# EAGLE design ArduinoMiniPro Breakout (EAGLE 6.5.0)
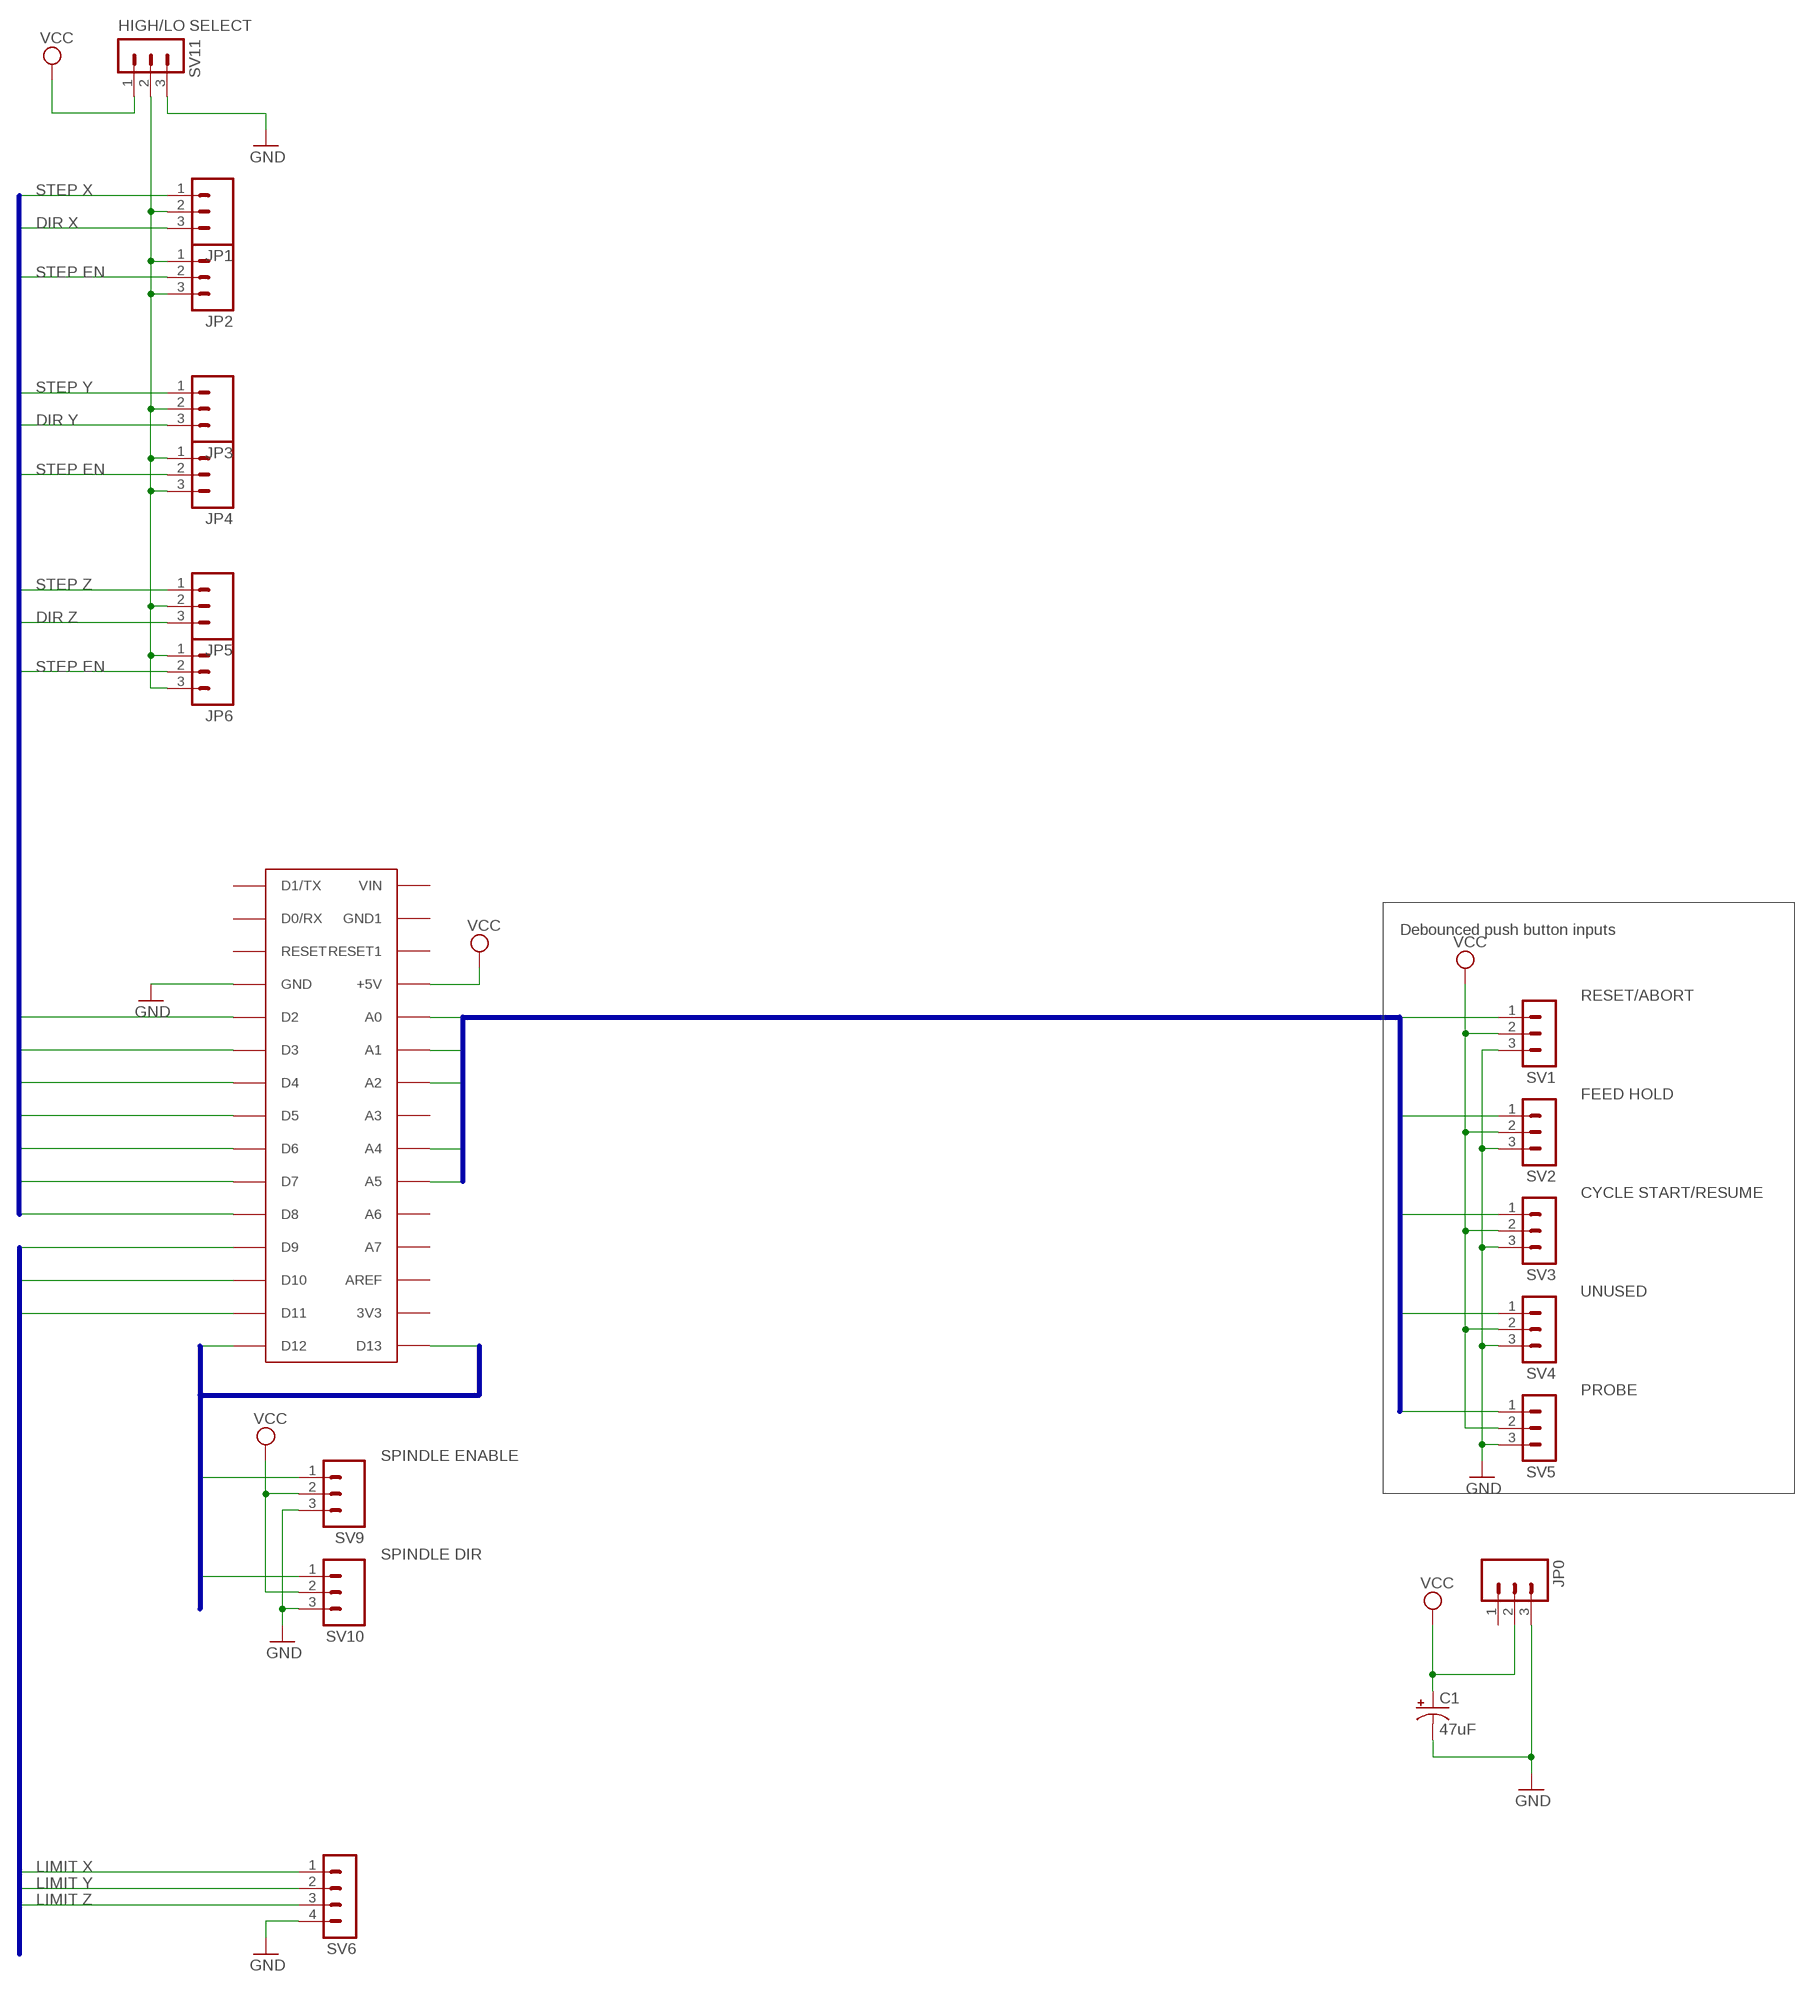
[diagram p0: schematic, sheet 1]

## Parts
C1  47uF  CAP_POLPTH2  [CPOL-RADIAL-10UF-25V]
JP0  M03-SCREW-5MM  [SCREWTERMINAL-5MM-3]
JP1  M03-SCREW-5MM  [SCREWTERMINAL-5MM-3]
JP2  M03-SCREW-5MM  [SCREWTERMINAL-5MM-3]
JP3  M03-SCREW-5MM  [SCREWTERMINAL-5MM-3]
JP4  M03-SCREW-5MM  [SCREWTERMINAL-5MM-3]
JP5  M03-SCREW-5MM  [SCREWTERMINAL-5MM-3]
JP6  M03-SCREW-5MM  [SCREWTERMINAL-5MM-3]
SV1  MA03-1  [MA03-1]
SV2  MA03-1  [MA03-1]
SV3  MA03-1  [MA03-1]
SV4  MA03-1  [MA03-1]
SV5  MA03-1  [MA03-1]
SV6  MA04-1  [MA04-1]
SV9  M03-SCREW-5MM  [SCREWTERMINAL-5MM-3]
SV10  M03-SCREW-5MM  [SCREWTERMINAL-5MM-3]
SV11  MA03-1  [MA03-1]
U$2  ARDUINONANO  [PDIP-32]

## Nets
B0: SV1.1 U$2.A0
B1: SV2.1 U$2.A1
B2: SV3.1 U$2.A2
B4: SV4.1 U$2.A4
B5: SV5.1 U$2.A5
GND: C1.2(-) JP0.3 SV1.3 SV2.3 SV3.3 SV4.3 SV5.3 SV6.4 SV9.3 SV10.3 SV11.3 U$2.GND
LIMITS0: SV6.1 U$2.D9
LIMITS1: SV6.2 U$2.D10
LIMITS2: SV6.3 U$2.D11
N$1: JP1.2 JP2.1 JP2.3 JP3.2 JP4.1 JP4.3 JP5.2 JP6.1 JP6.3 SV11.2
SPINDLE0: SV9.1 U$2.D12
SPINDLE1: SV10.1 U$2.D13
STEP0: JP1.1 U$2.D2
STEP1: JP3.1 U$2.D3
STEP2: JP5.1 U$2.D4
STEP3: JP1.3 U$2.D5
STEP4: JP3.3 U$2.D6
STEP5: JP5.3 U$2.D7
STEP6: JP2.2 JP4.2 JP6.2 U$2.D8
VCC: C1.1(+) JP0.2 SV1.2 SV2.2 SV3.2 SV4.2 SV5.2 SV9.2 SV10.2 SV11.1 U$2.+5V
Unconnected: JP0.1 U$2.3V3 U$2.A3 U$2.A6 U$2.A7 U$2.AREF U$2.D0/RX U$2.D1/TX U$2.GND1 U$2.RESET U$2.RESET1 U$2.VIN

## Buses
BUTTONS[0..5]
LIMITS[0..2]
SPINDLE[0..1]
STEP[0..6]

## Notes on the sheet
- HIGH/LO SELECT
- STEP X
- DIR X
- STEP EN
- STEP Y
- DIR Y
- STEP EN
- STEP Z
- DIR Z
- STEP EN
- Debounced push button inputs
- RESET/ABORT
- FEED HOLD
- CYCLE START/RESUME
- UNUSED
- PROBE
- SPINDLE ENABLE
- SPINDLE DIR
- LIMIT X
- LIMIT Y
- LIMIT Z

## Library data of the parts
C1 = SparkFun-Passives:CAP_POL: Capacitor Polarized These are standard SMD and PTH capacitors. Normally 10uF, 47uF, and 100uF in electrolytic and tantalum varieties. Always verify the external diameter of the through hole cap, it varies with capacity, voltage, and manufacturer. The EIA devices should be standard.
JP0 = MY-Connectors:M03: Header 3 Standard 3-pin 0.1" header. Use with straight break away headers (SKU : PRT-00116), right angle break away headers (PRT-00553), swiss pins (PRT-00743), machine pins (PRT-00117), and female headers (PRT-00115). Molex polarized connector foot print use with SKU : PRT-08232 with associated crimp pins and housings.; STOREFRONT_ID: PRT-08433
JP1-JP6 SV9 SV10 = SparkFun-Connectors:M03: Header 3 Standard 3-pin 0.1" header. Use with straight break away headers (SKU : PRT-00116), right angle break away headers (PRT-00553), swiss pins (PRT-00743), machine pins (PRT-00117), and female headers (PRT-00115). Molex polarized connector foot print use with SKU : PRT-08232 with associated crimp pins and housings.; STOREFRONT_ID: PRT-08433
SV1-SV5 SV11 = con-lstb:MA03-1: PIN HEADER; OC_FARNELL: unknown; OC_NEWARK: unknown
SV6 = con-lstb:MA04-1: PIN HEADER; OC_FARNELL: unknown; OC_NEWARK: unknown
U$2 = rocketfarm:ARDUINONANO

## Board
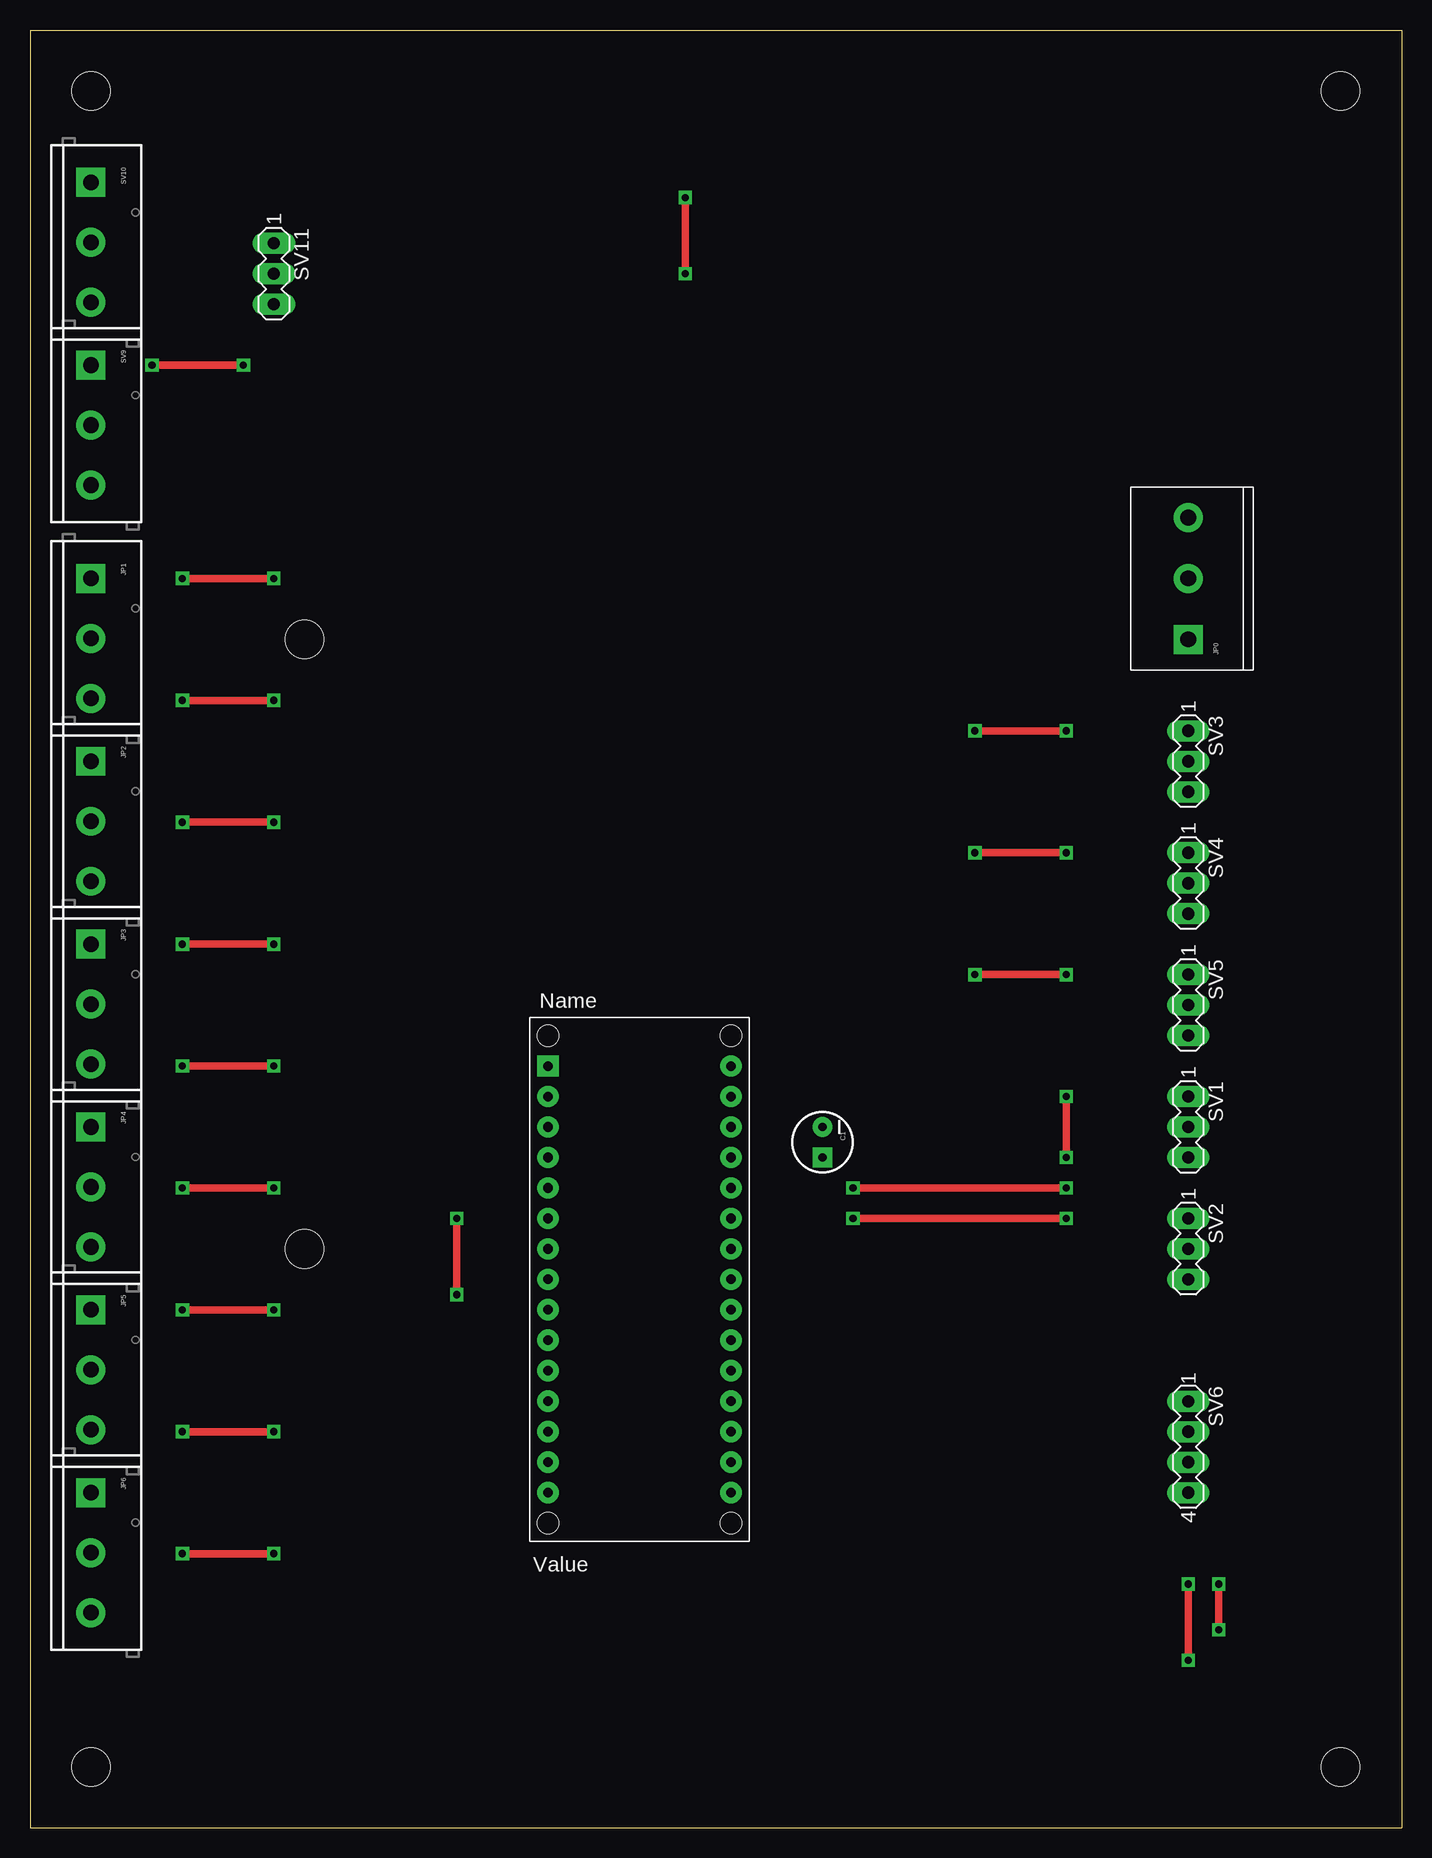
[diagram p1: board, top side]
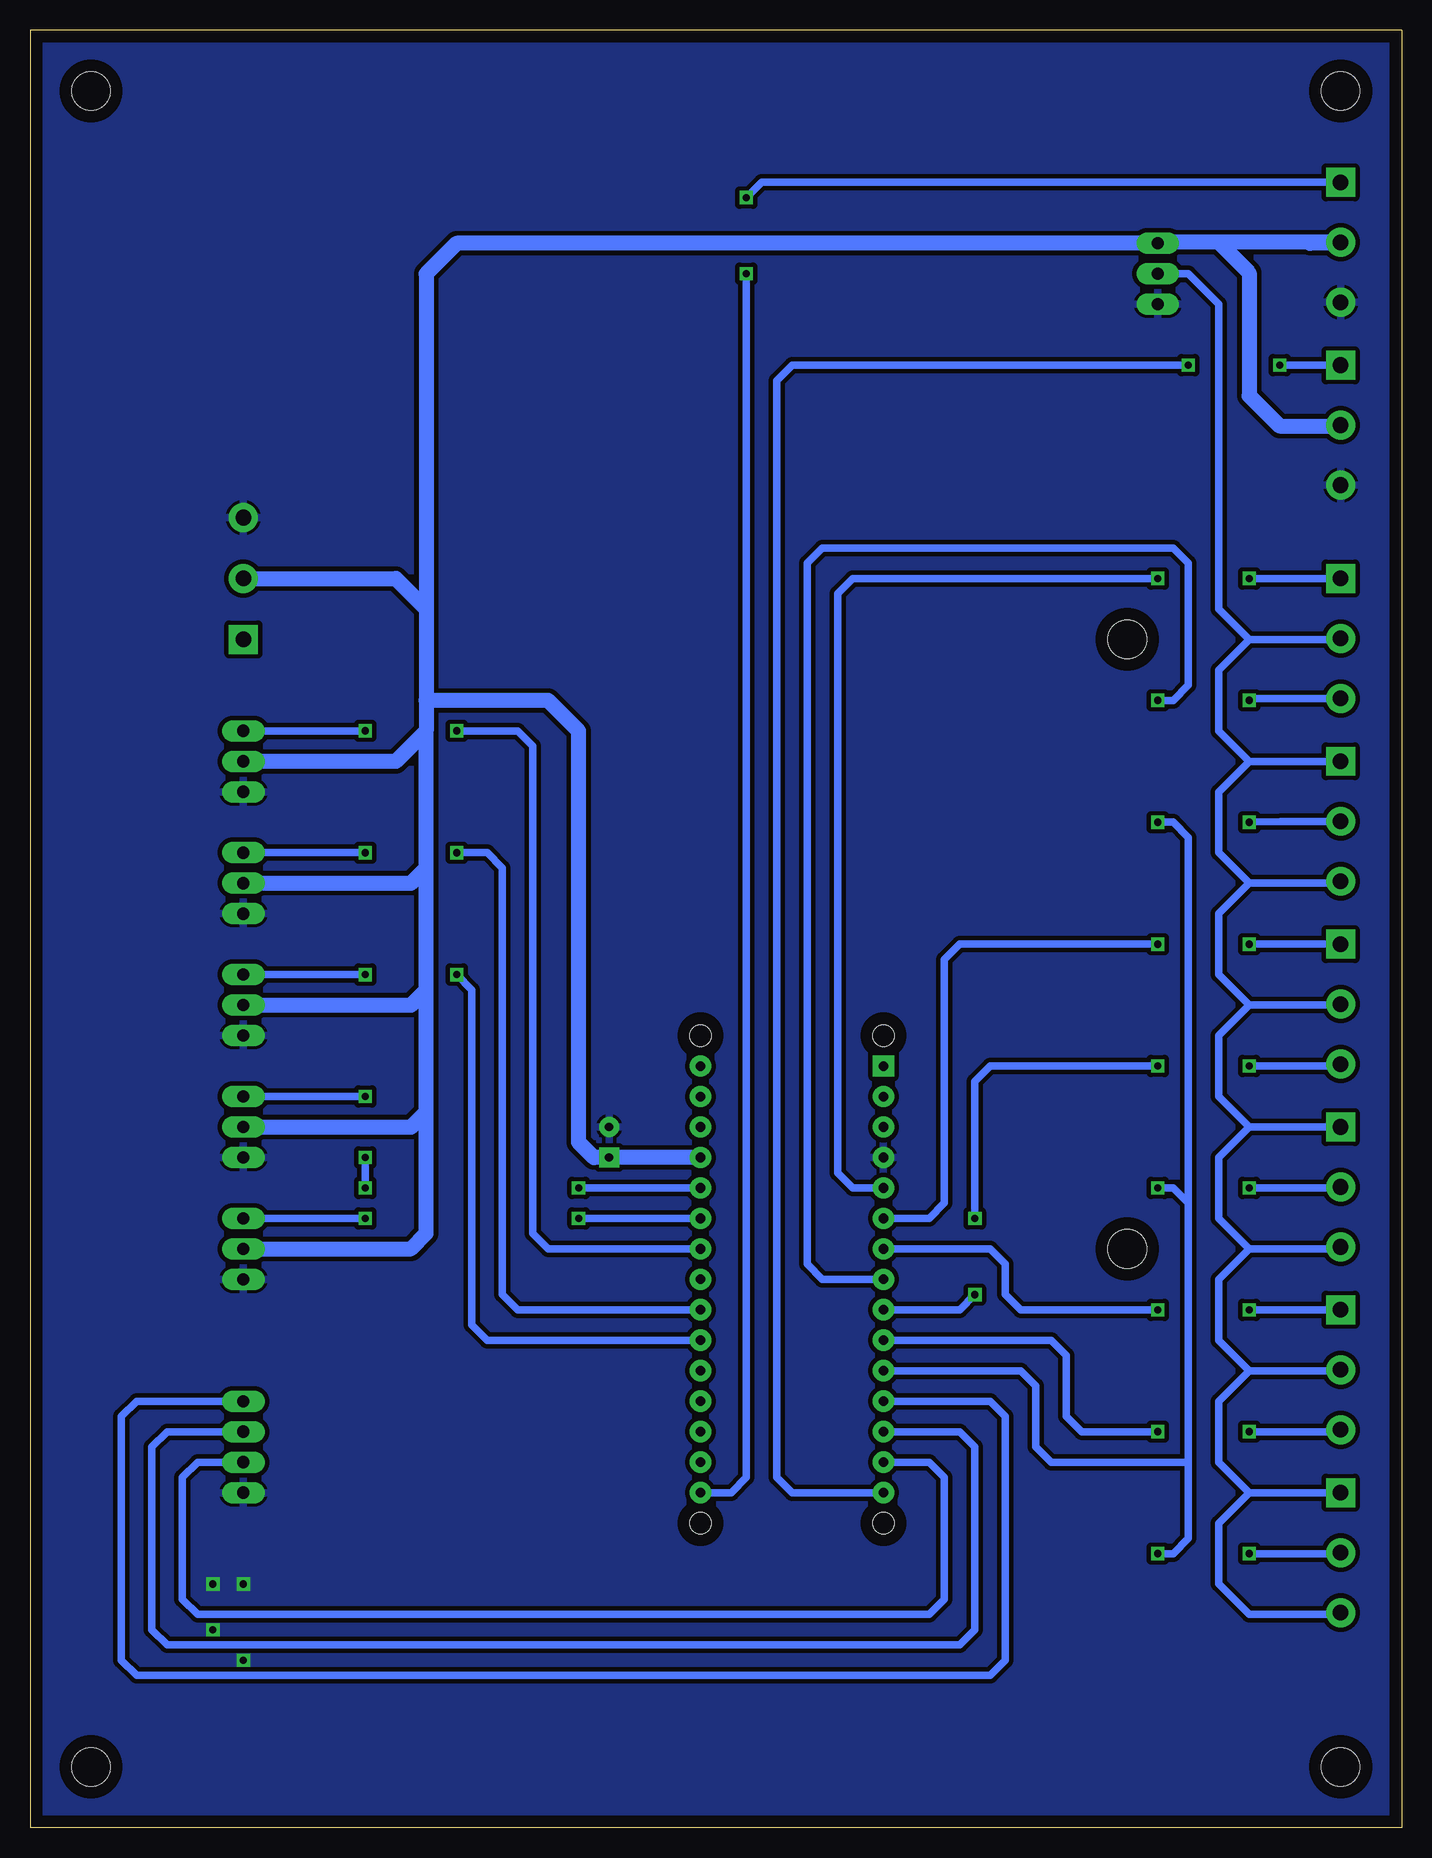
[diagram p2: board, bottom side, seen from below]

Size 114.3 x 149.86 mm. Coordinates in mm from the lower left corner, seen from the top.
Outline: 0,149.86 0,0 114.3,0 114.3,149.86 0,149.86
Copper layers (1*16): Top 0.035mm / dielectric 1.5mm / Bottom 0.035mm
Design rules "routedPCB *": minimum track width 10mil, minimum drill 20mil, track to track 15mil, track to pad 10mil, pad to pad 10mil, via to via 10mil, smd to smd 10mil, copper to edge 40mil, drill to drill 10mil, minimum pad ring 15mil, minimum via ring 10mil, stop-mask expansion 0mil, vias tented up to drill 0mil, thermal gap 10mil
Holes 3.2 mm at 5.08,144.78 5.08,5.08 109.22,5.08 109.22,144.78 22.86,48.26 22.86,99.06

### Footprints (pad centres in the part's own frame; a part is rotated, then mirrored left to right if it is on the bottom)
CPOL-RADIAL-10UF-25V = drill 0.7 pad 1.651 square: 1 1.27,0 | drill 0.7 pad 1.651: 2 -1.27,0
SCREWTERMINAL-5MM-3 = drill 1.3 pad 2.413 square: 1 0,0 | drill 1.3 pad 2.413: 2 5.076,0; 3 10.152,0
SCREWTERMINAL-5MM-3' = drill 1.3 pad 2.413 square: 1 0,0 | drill 1.3 pad 2.413: 2 5,0; 3 10,0
MA03-1 = drill 1.016 long: 1 -2.54,0; 2 0,0; 3 2.54,0
MA04-1 = drill 1.016 long: 1 -3.81,0; 2 -1.27,0; 3 1.27,0; 4 3.81,0
PDIP-32 = drill 0.8 pad 1.778: 3V3 15.24,-35.56; +5V 15.24,-10.16; A0 15.24,-12.7; A1 15.24,-15.24; A2 15.24,-17.78; A3 15.24,-20.32; A4 15.24,-22.86; A5 15.24,-25.4; A6 15.24,-27.94; A7 15.24,-30.48; AREF 15.24,-33.02; D0/RX 0,-5.08; D2 0,-12.7; D3 0,-15.24; D4 0,-17.78; D5 0,-20.32; D6 0,-22.86; D7 0,-25.4; D8 0,-27.94; D9 0,-30.48; D10 0,-33.02; D11 0,-35.56; D12 0,-38.1; D13 15.24,-38.1; GND 0,-10.16; GND1 15.24,-5.08; RESET 0,-7.62; RESET1 15.24,-7.62; VIN 15.24,-2.54 | drill 0.8 pad 1.778 square: D1/TX 0,-2.54 | hole 1.778: 0,0; 0,-40.64; 15.24,-40.64; 15.24,0

### Placement (x,y rotation side)
C1  66.04,57.15 270 top
JP0  96.52,99.06 90 top
JP1  [SCREWTERMINAL-5MM-3']  5.08,104.14 270 top
JP2  [SCREWTERMINAL-5MM-3']  5.08,88.9 270 top
JP3  [SCREWTERMINAL-5MM-3']  5.08,73.66 270 top
JP4  [SCREWTERMINAL-5MM-3']  5.08,58.42 270 top
JP5  [SCREWTERMINAL-5MM-3']  5.08,43.18 270 top
JP6  [SCREWTERMINAL-5MM-3']  5.08,27.94 270 top
SV1  96.52,58.42 270 top
SV2  96.52,48.26 270 top
SV3  96.52,88.9 270 top
SV4  96.52,78.74 270 top
SV5  96.52,68.58 270 top
SV6  96.52,31.75 270 top
SV9  [SCREWTERMINAL-5MM-3']  5.08,121.92 270 top
SV10  [SCREWTERMINAL-5MM-3']  5.08,137.16 270 top
SV11  20.32,129.54 270 top
U$2  43.18,66.04 0 top

### Tracks (layer width: path | path; a pad name or v marks a point on that pad's centre or on a via)
B0  (via drill 0.6)
  Top 0.61: v68.58,53.34 v86.36,53.34 | v86.36,55.88 v86.36,60.96
  Bottom 0.61: U$2.A0 v68.58,53.34 | v86.36,53.34 v86.36,55.88 | v86.36,60.96 SV1.1
B1  (via drill 0.6)
  Top 0.61: v68.58,50.8 v86.36,50.8
  Bottom 0.61: U$2.A1 v68.58,50.8 | v86.36,50.8 SV2.1
B2  (via drill 0.6)
  Top 0.61: v78.74,91.44 v86.36,91.44
  Bottom 0.61: U$2.A2 71.12,48.26 72.39,49.53 72.39,90.17 73.66,91.44 v78.74,91.44 | v86.36,91.44 SV3.1
B4  (via drill 0.6)
  Top 0.61: v78.74,81.28 v86.36,81.28
  Bottom 0.61: U$2.A4 73.66,43.18 74.93,44.45 74.93,80.01 76.2,81.28 v78.74,81.28 | v86.36,81.28 SV4.1
B5  (via drill 0.6)
  Top 0.61: v78.74,71.12 v86.36,71.12
  Bottom 0.61: U$2.A5 76.2,40.64 77.47,41.91 77.47,69.85 v78.74,71.12 | v86.36,71.12 SV5.1
GND  (via drill 0.6)
  Top 0.61: v96.52,20.32 v96.52,13.97 | v99.06,20.32 v99.06,16.51
  pour Bottom: 0,149.86 114.3,149.86 114.3,0 0,0
LIMITS0
  Bottom 0.61: U$2.D9 34.29,35.56 33.02,34.29 33.02,13.97 34.29,12.7 105.41,12.7 106.68,13.97 106.68,34.29 105.41,35.56 SV6.1
LIMITS1
  Bottom 0.61: U$2.D10 36.83,33.02 35.56,31.75 35.56,16.51 36.83,15.24 102.87,15.24 104.14,16.51 104.14,31.75 102.87,33.02 SV6.2
LIMITS2
  Bottom 0.61: SV6.3 100.33,30.48 101.6,29.21 101.6,19.05 100.33,17.78 39.37,17.78 38.1,19.05 38.1,29.21 39.37,30.48 U$2.D11
N$1
  Bottom 0.61: SV11.2 17.78,129.54 15.24,127 15.24,101.6 12.7,99.06 | 12.7,99.06 5.16,99.06 | 5.16,99.06 JP1.2 5.08,99.06 5.16,99.06 | 12.7,88.9 15.24,91.44 15.24,96.52 12.7,99.06 | JP2.1 12.7,88.9 | 12.7,88.9 15.24,86.36 15.24,81.28 12.7,78.74 | 12.7,78.74 15.24,76.2 15.24,71.12 12.7,68.58 | 12.7,68.58 15.24,66.04 15.24,60.96 12.7,58.42 | 12.7,58.42 15.24,55.88 15.24,50.8 12.7,48.26 | 12.7,48.26 15.24,45.72 15.24,40.64 12.7,38.1 | 12.7,38.1 15.24,35.56 15.24,30.48 12.7,27.94 | 12.7,27.94 15.24,25.4 15.24,20.32 12.7,17.78 5.24,17.78 JP6.3 | 12.7,27.94 JP6.1 | 12.7,38.1 5.16,38.1 JP5.2 | 12.7,48.26 5.24,48.26 JP4.3 | 12.7,58.42 JP4.1 | 12.7,68.58 5.16,68.58 JP3.2 | 12.7,78.74 5.24,78.74 JP2.3
SPINDLE0  (via drill 0.6)
  Top 0.61: v10.16,121.92 v17.78,121.92
  Bottom 0.61: SV9.1 v10.16,121.92 | v17.78,121.92 50.8,121.92 52.07,120.65 52.07,29.21 50.8,27.94 U$2.D12
SPINDLE1  (via drill 0.6)
  Top 0.61: v54.61,129.54 v54.61,135.89
  Bottom 0.61: v54.61,129.54 54.61,29.21 55.88,27.94 U$2.D13 | SV10.1 53.34,137.16 v54.61,135.89
STEP0  (via drill 0.6)
  Top 0.61: v12.7,104.14 v20.32,104.14
  Bottom 0.61: JP1.1 v12.7,104.14 | v20.32,104.14 45.72,104.14 46.99,102.87 46.99,54.61 45.72,53.34 U$2.D2
STEP1  (via drill 0.6)
  Top 0.61: v12.7,73.66 v20.32,73.66
  Bottom 0.61: JP3.1 v12.7,73.66 | v20.32,73.66 36.83,73.66 38.1,72.39 38.1,52.07 39.37,50.8 U$2.D3
STEP2  (via drill 0.6)
  Top 0.61: v12.7,43.18 v20.32,43.18
  Bottom 0.61: JP5.1 v12.7,43.18 | U$2.D4 34.29,48.26 33.02,46.99 33.02,44.45 31.75,43.18 v20.32,43.18
STEP3  (via drill 0.6)
  Top 0.61: v12.7,93.98 v20.32,93.98
  Bottom 0.61: JP1.3 12.54,94.14 v12.7,93.98 | v20.32,93.98 19.05,93.98 17.78,95.25 17.78,105.41 19.05,106.68 48.26,106.68 49.53,105.41 49.53,46.99 48.26,45.72 U$2.D5
STEP4  (via drill 0.6)
  Top 0.61: v12.7,63.5 v20.32,63.5 | v35.56,50.8 v35.56,44.45
  Bottom 0.61: JP3.3 5.08,63.5 v12.7,63.5 | v20.32,63.5 34.29,63.5 35.56,62.23 v35.56,50.8 | v35.56,44.45 36.83,43.18 U$2.D6
STEP5  (via drill 0.6)
  Top 0.61: v20.32,33.02 v12.7,33.02
  Bottom 0.61: v12.7,33.02 5.24,33.02 JP5.3 | v20.32,33.02 26.67,33.02 27.94,34.29 27.94,39.37 29.21,40.64 U$2.D7
STEP6  (via drill 0.6)
  Top 0.61: v20.32,22.86 v12.7,22.86 | v20.32,53.34 v12.7,53.34 | v12.7,83.82 v20.32,83.82
  Bottom 0.61: 5.08,22.86 JP6.2 5.16,22.86 v12.7,22.86 | v12.7,53.34 5.16,53.34 JP4.2 | v12.7,83.82 10.08,83.9 JP2.2 5.08,83.82 | U$2.D8 31.75,38.1 30.48,36.83 30.48,31.75 29.21,30.48 17.78,30.48 | v20.32,22.86 19.05,22.86 17.78,24.13 17.78,30.48 | 17.78,30.48 17.78,52.07 | 17.78,52.07 19.05,53.34 v20.32,53.34 | v20.32,83.82 19.05,83.82 17.78,82.55 17.78,52.07
VCC
  Bottom 1.27: JP0.2 83.82,104.14 81.28,101.6 | 81.28,101.6 81.28,93.98 | 81.28,93.98 81.28,91.44 | 81.28,91.44 83.82,88.9 SV3.2 | SV4.2 82.55,78.74 81.28,80.01 | 81.28,80.01 81.28,91.44 | SV5.2 82.55,68.58 81.28,69.85 | 81.28,69.85 81.28,80.01 | SV1.2 82.55,58.42 81.28,59.69 | 81.28,59.69 81.28,69.85 | SV2.2 82.55,48.26 81.28,49.53 81.28,59.69 | 81.28,101.6 81.28,129.54 78.74,132.08 SV11.1 20.24,132.16 15.24,132.16 | U$2.+5V C1.1 67.31,55.88 68.58,57.15 68.58,91.44 71.12,93.98 81.28,93.98 | 15.24,132.16 SV10.2 5.08,132.08 7.62,132.08 | 15.24,132.16 12.7,129.62 12.7,119.38 10.16,116.84 5.16,116.84 SV9.2